# EAGLE design LasaurShield (EAGLE 5.11)
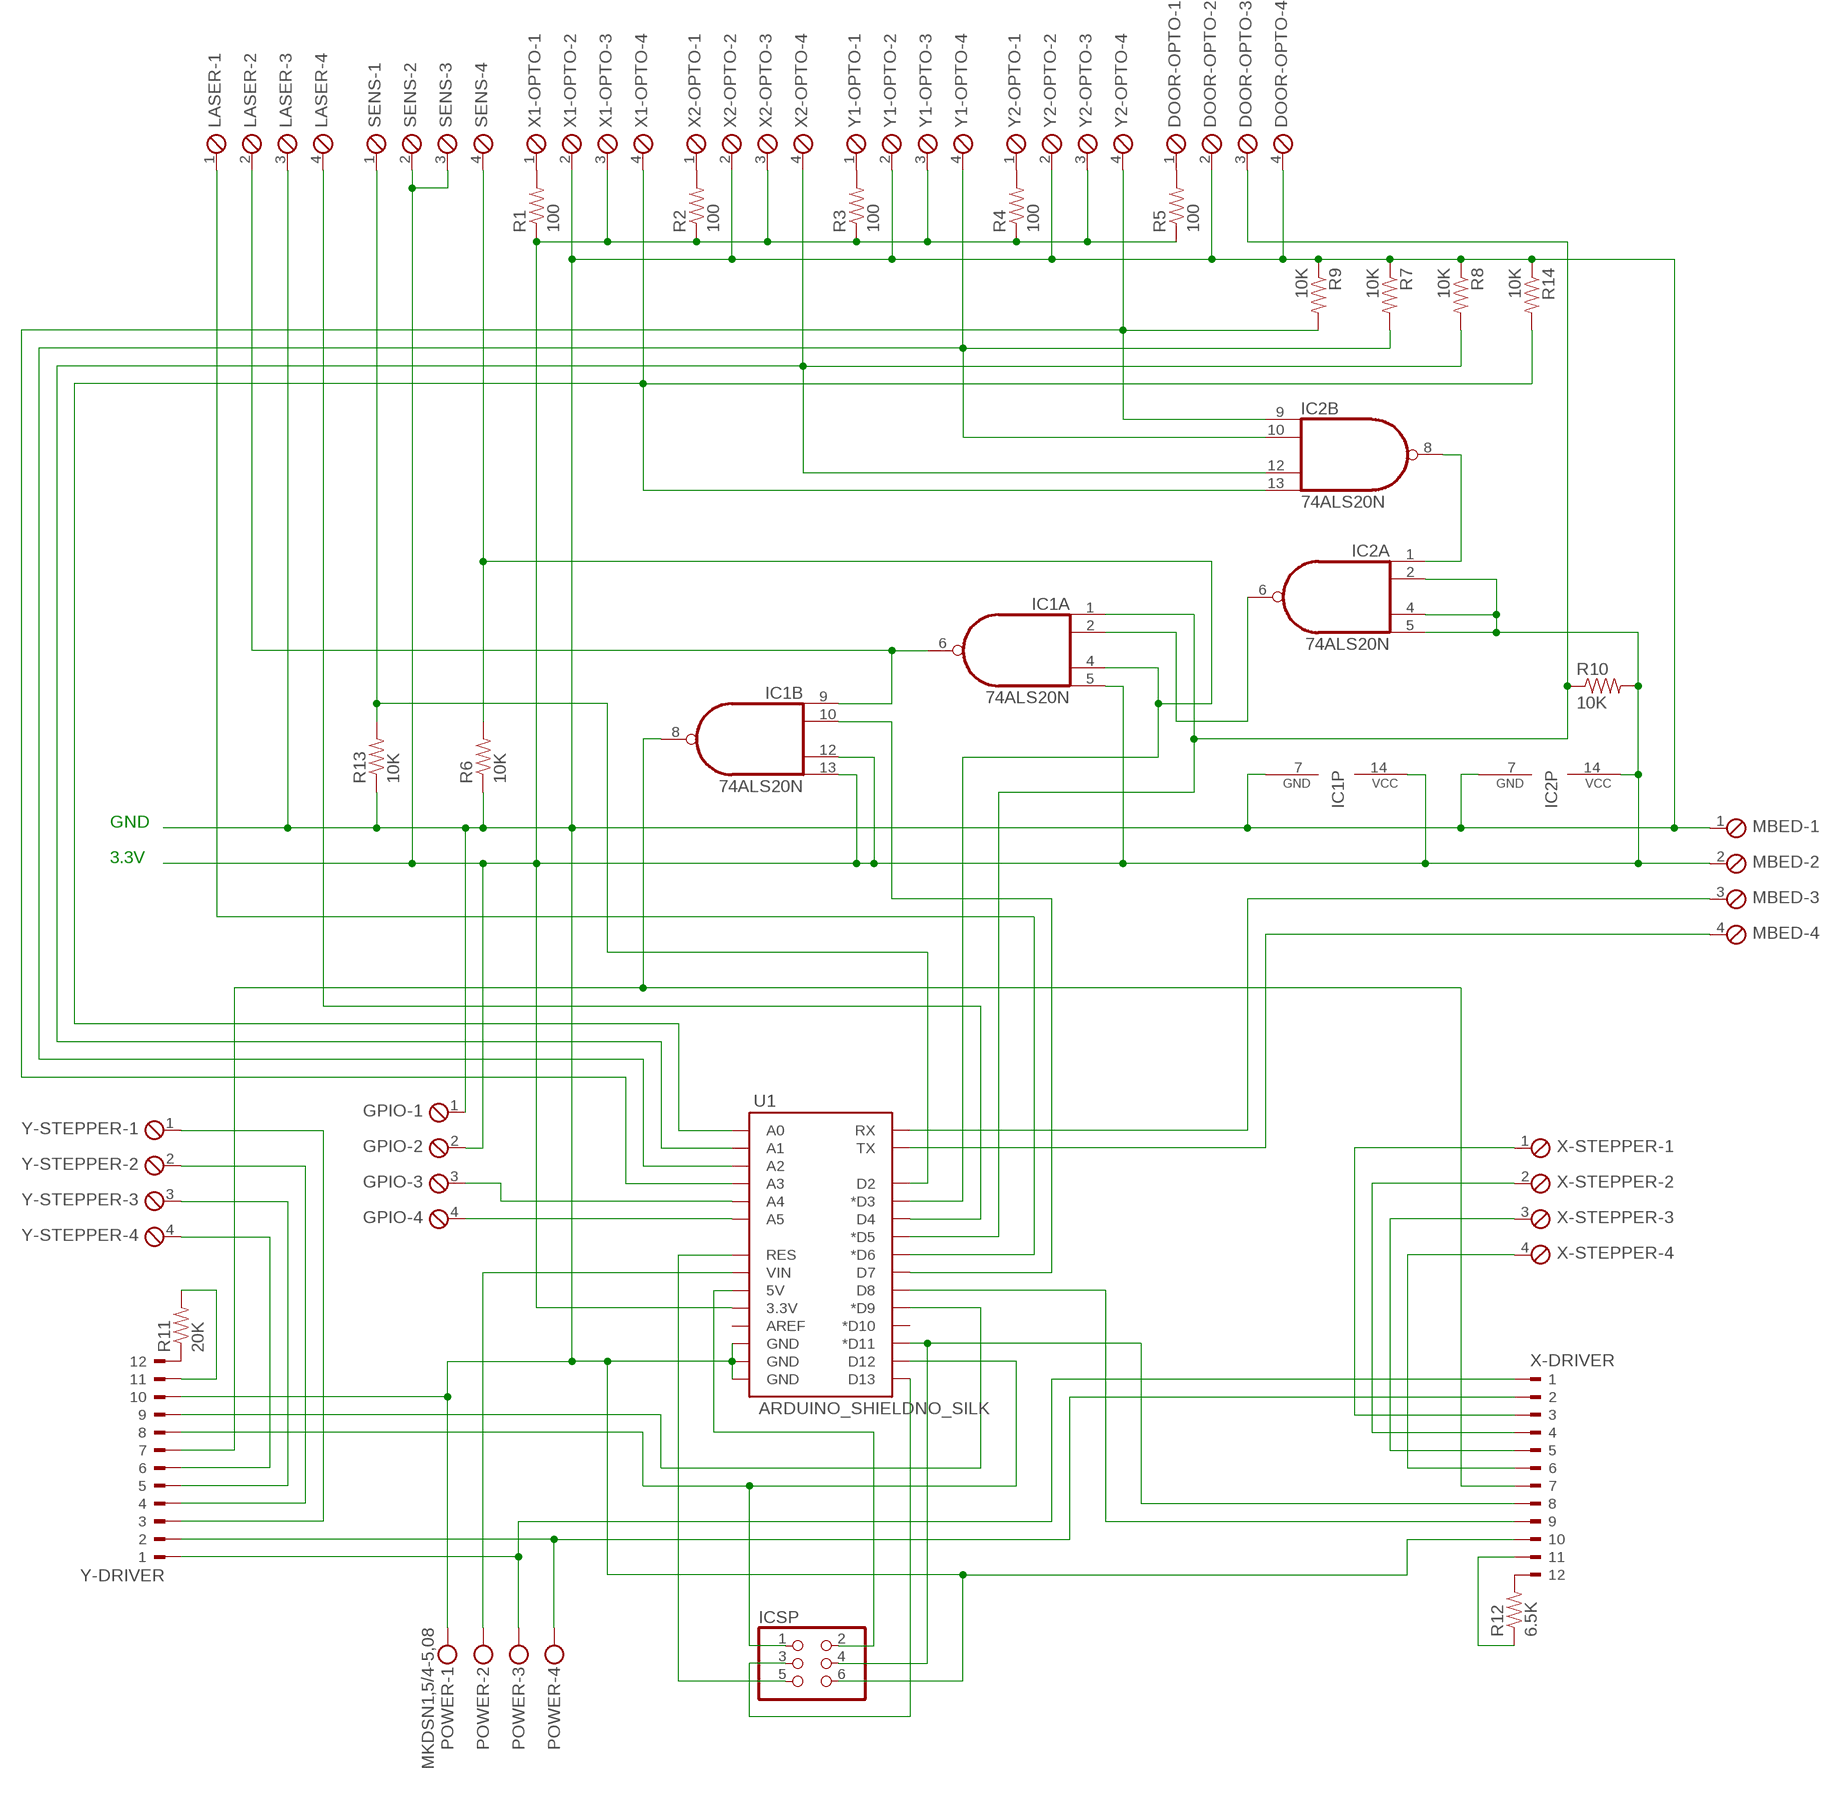
[diagram p0: schematic, sheet 1]

## Parts
DOOR-OPTO  MPT4  [4POL254]
GPIO  MPT4  [4POL254]
IC1  74ALS20N  [DIL14]
IC2  74ALS20N  [DIL14]
ICSP  PINHD-2X3  [2X03]
LASER  MPT4  [4POL254]
MBED  MPT4  [4POL254]
POWER  MKDSN1,5/4-5,08  [MKDSN1,5/4-5,08]
R1  100  RESISTORPTH-1/4W  [AXIAL-0.4]
R2  100  RESISTORPTH-1/4W  [AXIAL-0.4]
R3  100  RESISTORPTH-1/4W  [AXIAL-0.4]
R4  100  RESISTORPTH-1/4W  [AXIAL-0.4]
R5  100  RESISTORPTH-1/4W  [AXIAL-0.4]
R6  10K  RESISTORPTH-1/4W  [AXIAL-0.4]
R7  10K  RESISTORPTH-1/4W  [AXIAL-0.4]
R8  10K  RESISTORPTH-1/4W  [AXIAL-0.4]
R9  10K  RESISTORPTH-1/4W  [AXIAL-0.4]
R10  10K  RESISTORPTH-1/4W  [AXIAL-0.4]
R11  20K  RESISTORPTH-1/4W  [AXIAL-0.4]
R12  6.5K  RESISTORPTH-1/4W  [AXIAL-0.4]
R13  10K  RESISTORPTH-1/4W  [AXIAL-0.4]
R14  10K  RESISTORPTH-1/4W  [AXIAL-0.4]
SENS  MPT4  [4POL254]
U1  ARDUINO_SHIELDNO_SILK  [DUEMILANOVE_VIAS]
X1-OPTO  MPT4  [4POL254]
X2-OPTO  MPT4  [4POL254]
X-DRIVER  180-12  [180-12]
X-STEPPER  MPT4  [4POL254]
Y1-OPTO  MPT4  [4POL254]
Y2-OPTO  MPT4  [4POL254]
Y-DRIVER  180-12  [180-12]
Y-STEPPER  MPT4  [4POL254]

## Nets
N$1 [arduino power]: POWER.2 U1.VIN
N$2: GPIO.3 U1.A4
N$3 [stepper power]: POWER.3 X-DRIVER.1 Y-DRIVER.1
N$4 [stepper power]: POWER.4 X-DRIVER.2 Y-DRIVER.2
N$5: IC2.13(B:I3) R14.P$2 U1.A0 X1-OPTO.4
N$6: R1.P$2 X1-OPTO.1
N$7: IC1.2(A:I1) IC2.6(A:O)
N$8: IC2.9(B:I0) R9.P$2 U1.A3 Y2-OPTO.4
N$9: IC2.1(A:I0) IC2.8(B:O)
N$10: GPIO.4 U1.A5
N$11: IC1.6(A:O) IC1.9(B:I0) LASER.2
N$12: DOOR-OPTO.3 IC1.1(A:I0) R10.P$1 U1.D5(*D5)
N$13: IC1.10(B:I1) U1.D7
N$14: R11.P$1 Y-DRIVER.12
N$15: R11.P$2 Y-DRIVER.11
N$16: R12.P$2 X-DRIVER.12
N$17: R12.P$1 X-DRIVER.11
N$18: R2.P$2 X2-OPTO.1
N$19: R3.P$2 Y1-OPTO.1
N$20: R4.P$2 Y2-OPTO.1
N$21: DOOR-OPTO.1 R5.P$2
N$22 [stepper control]: Y-DRIVER.3 Y-STEPPER.1
N$23 [stepper control]: Y-DRIVER.4 Y-STEPPER.2
N$24 [stepper control]: Y-DRIVER.5 Y-STEPPER.3
N$25 [stepper control]: Y-DRIVER.6 Y-STEPPER.4
N$26 [stepper control]: X-DRIVER.3 X-STEPPER.1
N$27 [stepper control]: X-DRIVER.4 X-STEPPER.2
N$28 [stepper control]: X-DRIVER.5 X-STEPPER.3
N$29 [stepper control]: X-DRIVER.6 X-STEPPER.4
N$30: ICSP.4 U1.D11(*D11) X-DRIVER.8
N$31: U1.D9(*D9) Y-DRIVER.9
N$32: U1.D8 X-DRIVER.9
N$33 [arduino power]: DOOR-OPTO.2 DOOR-OPTO.4 GPIO.1 IC1.7(P:GND) IC2.7(P:GND) ICSP.6 LASER.3 MBED.1 POWER.1 R6.P$1 R7.P$1 R8.P$1 R9.P$1 R13.P$1 R14.P$1 U1.GND@0(GND) U1.GND@1(GND) U1.GND@2(GND) X1-OPTO.2 X2-OPTO.2 X-DRIVER.10 Y1-OPTO.2 Y2-OPTO.2 Y-DRIVER.10
N$34: IC2.12(B:I2) R8.P$2 U1.A1 X2-OPTO.4
N$35: LASER.1 U1.D6(*D6)
N$36: IC1.4(A:I2) R6.P$2 SENS.4 U1.D3(*D3)
N$37: IC1.8(B:O) X-DRIVER.7 Y-DRIVER.7
N$38: LASER.4 U1.D4
N$39: R13.P$2 SENS.1 U1.D2
N$41: ICSP.3 U1.D13
N$42: ICSP.5 U1.RES
N$43: MBED.3 U1.RX
N$44: ICSP.2 U1.5V
N$45: MBED.4 U1.TX
N$49: ICSP.1 U1.D12 Y-DRIVER.8
N$50: GPIO.2 IC1.5(A:I3) IC1.12(B:I2) IC1.13(B:I3) IC1.14(P:VCC) IC2.2(A:I1) IC2.4(A:I2) IC2.5(A:I3) IC2.14(P:VCC) MBED.2 R1.P$1 R2.P$1 R3.P$1 R4.P$1 R5.P$1 R10.P$2 SENS.2 SENS.3 U1.3.3V X1-OPTO.3 X2-OPTO.3 Y1-OPTO.3 Y2-OPTO.3
N$51: IC2.10(B:I1) R7.P$2 U1.A2 Y1-OPTO.4
Unconnected: U1.AREF U1.D10(*D10)

## Notes on the sheet
- GND
- 3.3V

## Library data of the parts
DOOR-OPTO GPIO LASER MBED SENS X1-OPTO X2-OPTO X-STEPPER Y1-OPTO Y2-OPTO Y-STEPPER = con-phoenix-254:MPT4: PHOENIX CONNECTOR; OC_FARNELL: unknown; OC_NEWARK: unknown
IC1 IC2 = 74xx-us:74*20: Dual 4-input NAND gate
ICSP = SparkFun:PINHD-2X3: PIN HEADER
POWER = con-phoenix-508:MKDSN1,5/4-5,08: MKDSN 1,5/ 4-5,08 Printklemme Nennstrom: 13,5 A Nennspannung: 250 V Rastermaß: 5,08 mm Polzahl: 4 Anschlussart: Schraubanschluss Montage: Löten Anschlussrichtung Leiter/Platine: 0 ° Artikelnummer: 1729144 Source: http://eshop.phoenixcontact.com .. 1729144.pdf; MPN: SMKDSN1,5/4-5,08; OC_FARNELL: 1792905; OC_NEWARK: 70R0300
R1-R14 = SparkFun:RESISTOR: Resistor Basic schematic elements and footprints for 0603, 1206, and PTH resistors.
U1 = SparkFun:ARDUINO_SHIELD
X-DRIVER Y-DRIVER = con-weidmueller-sl35:180-12: WEIDMUELLER CLAMP CONNECTOR; OC_FARNELL: unknown; OC_NEWARK: unknown

## Net classes
1 stepper power: width 2.032 mm, drill 0.508 mm, clearance 0.508 mm
2 stepper control: width 1.27 mm, drill 0.381 mm, clearance 0.381 mm
3 arduino power: width 1.016 mm, drill 0.254 mm, clearance 0.254 mm

## Board
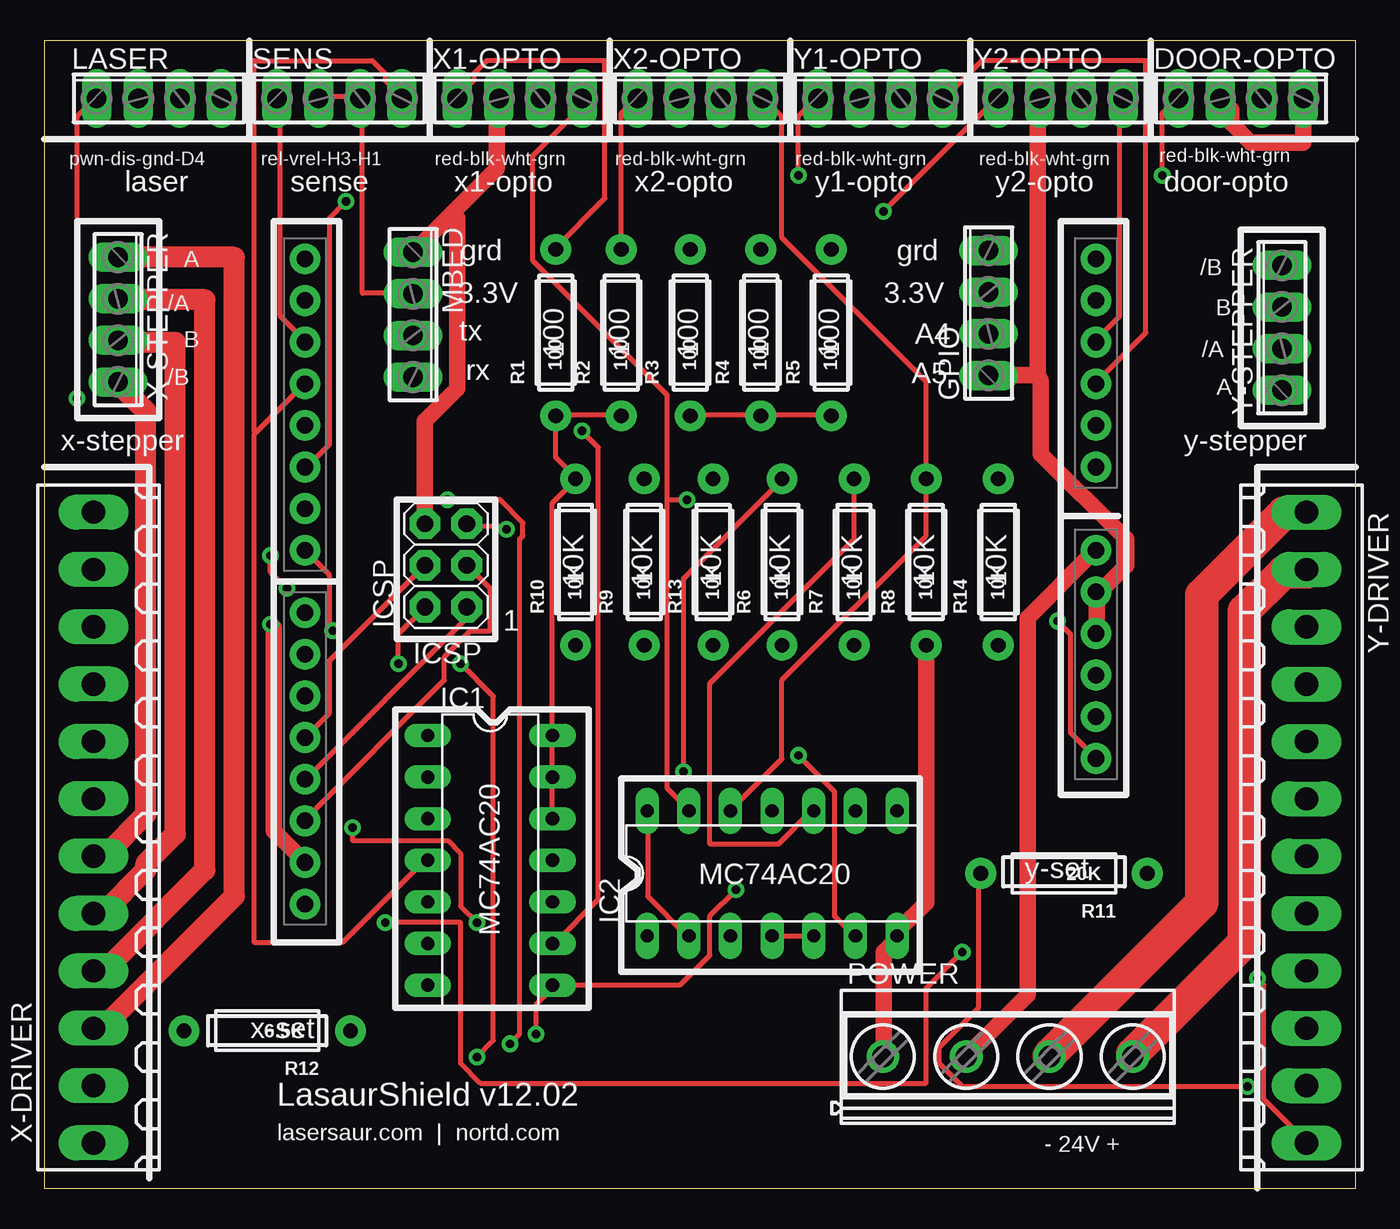
[diagram p1: board, top side]
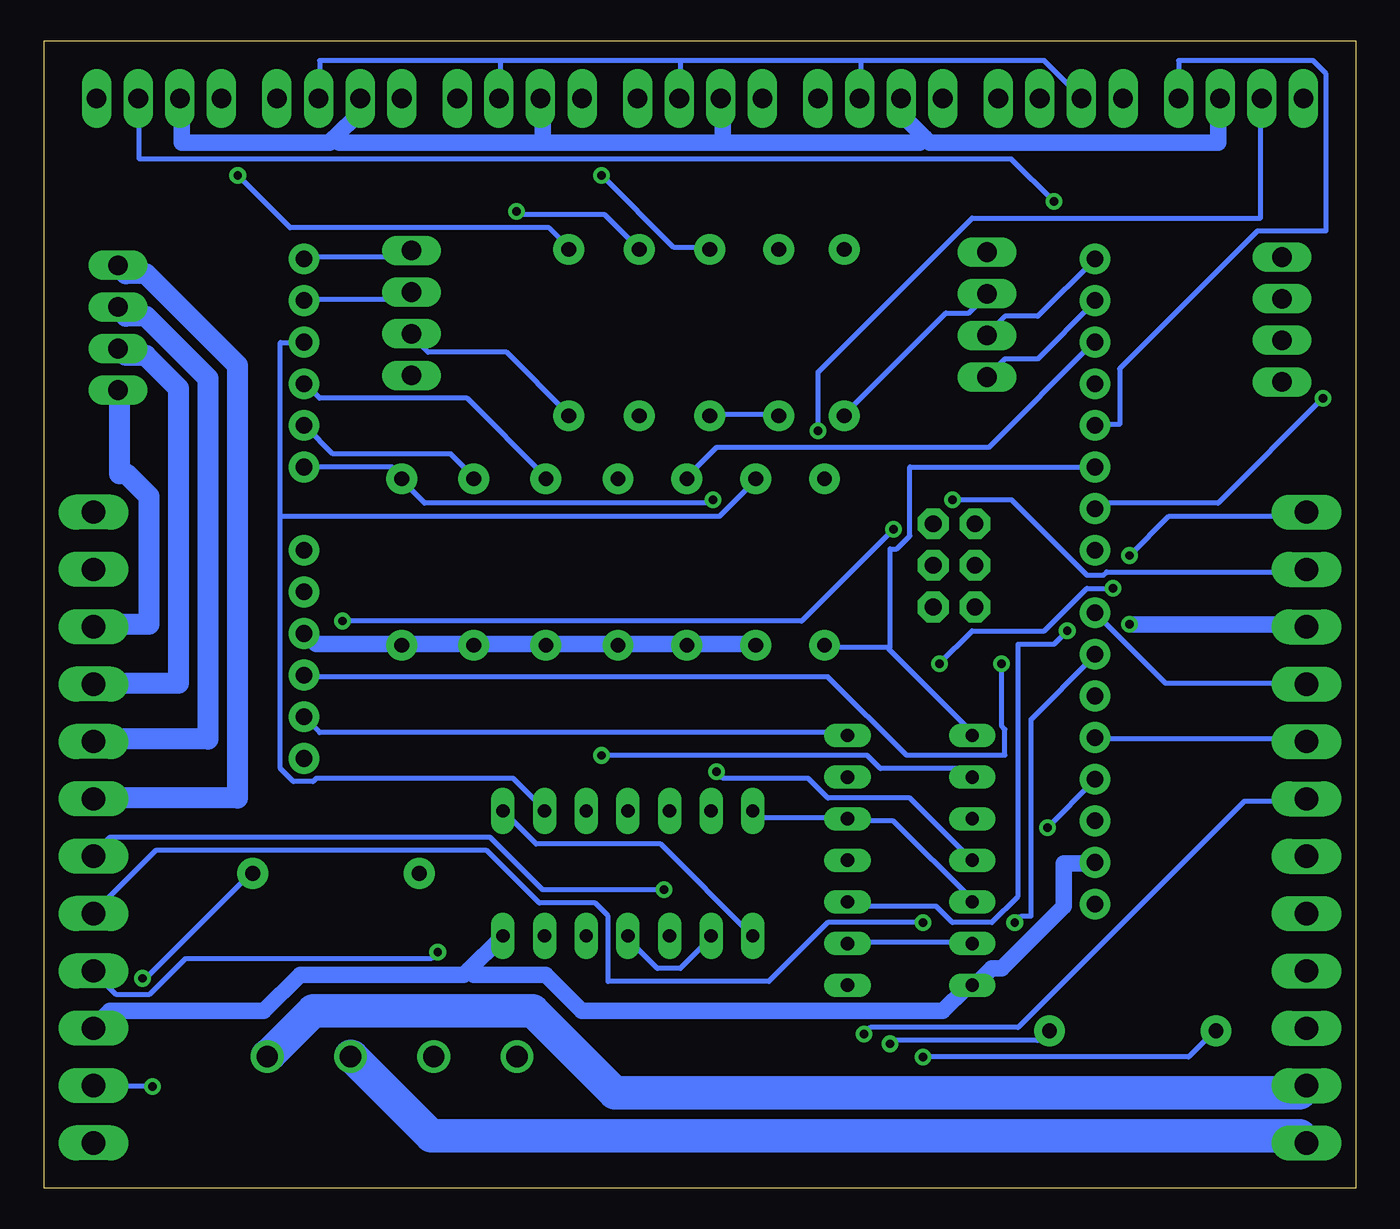
[diagram p2: board, bottom side, seen from below]

Size 80 x 70 mm. Coordinates in mm from the lower left corner, seen from the top.
Outline: 0,0 80,0 80,70 0,70 0,0
Copper layers (1*16): Top 0.035mm / dielectric 1.5mm / Bottom 0.035mm
Design rules "LasaurShield": minimum track width 12mil, minimum drill 20mil, track to track 12mil, track to pad 12mil, pad to pad 12mil, via to via 12mil, smd to smd 8mil, copper to edge 15mil, drill to drill 12mil, minimum pad ring 12mil, minimum via ring 10mil, stop-mask expansion 4mil, vias tented up to drill 25mil, thermal gap 10mil

### Footprints (pad centres in the part's own frame; a part is rotated, then mirrored left to right if it is on the bottom)
4POL254 = drill 1.2 long: 1 -3.81,0; 2 -1.27,0; 3 1.27,0; 4 3.81,0
DIL14 = drill 0.813 long: 1 -7.62,-3.81; 2 -5.08,-3.81; 3 -2.54,-3.81; 4 0,-3.81; 5 2.54,-3.81; 6 5.08,-3.81; 7 7.62,-3.81; 8 7.62,3.81; 9 5.08,3.81; 10 2.54,3.81; 11 0,3.81; 12 -2.54,3.81; 13 -5.08,3.81; 14 -7.62,3.81
2X03 = drill 1.016 pad 1.88 octagon: 1 -2.54,-1.27; 2 -2.54,1.27; 3 0,-1.27; 4 0,1.27; 5 2.54,-1.27; 6 2.54,1.27
MKDSN1,5/4-5,08 = drill 1.3 pad 2 round: 1 -7.641,0.025; 2 -2.561,0.025; 3 2.519,0.025; 4 7.599,0.025
AXIAL-0.4 = drill 0.9 pad 1.88 round: P$1 -5.08,0; P$2 5.08,0
DUEMILANOVE_VIAS = drill 1.016 pad 1.88 round: 3.3V 50.8,13.97; 5V 50.8,16.51; A0 50.8,29.21; A1 50.8,31.75; A2 50.8,34.29; A3 50.8,36.83; A4 50.8,39.37; A5 50.8,41.91; AREF 2.54,2.54; D2 2.54,36.83; D3 2.54,34.29; D4 2.54,31.75; D5 2.54,29.21; D6 2.54,26.67; D7 2.54,24.13; D8 2.54,20.32; D9 2.54,17.78; D10 2.54,15.24; D11 2.54,12.7; D12 2.54,10.16; D13 2.54,7.62; GND@0 50.8,19.05; GND@1 50.8,21.59; GND@2 2.54,5.08; RES 50.8,11.43; RX 2.54,41.91; TX 2.54,39.37; VIN 50.8,24.13
180-12 = drill 1.422 long: 1 -19.25,0; 2 -15.75,0; 3 -12.25,0; 4 -8.75,0; 5 -5.25,0; 6 -1.75,0; 7 1.75,0; 8 5.25,0; 9 8.75,0; 10 12.25,0; 11 15.75,0; 12 19.25,0

### Placement (x,y rotation side)
DOOR-OPTO  73,66.5 0 top
GPIO  57.6,53.4 90 top
IC1  27.2,20 270 top
IC2  44.4,19.2 0 top
ICSP  24.5,38 90 top
LASER  7,66.5 0 top
MBED  22.5,53.3 270 top
POWER  58.8,8 0 top
R1  31.2,52.2 90 top
R2  35.2,52.2 90 top
R3  39.4,52.2 90 top
R4  43.7,52.2 90 top
R5  48,52.2 90 top
R6  45,38.2 90 top
R7  49.4,38.2 90 top
R8  53.8,38.2 90 top
R9  36.6,38.2 90 top
R10  32.4,38.2 90 top
R11  62.2,19.2 180 top
R12  13.6,9.6 180 top
R13  40.8,38.2 90 top
R14  58.2,38.2 90 top
SENS  18,66.5 0 top
U1  13.36,14.79 0 top
X1-OPTO  29,66.5 0 top
X2-OPTO  40,66.5 0 top
X-DRIVER  3,22 90 top
X-STEPPER  4.5,53 270 top
Y1-OPTO  51,66.5 0 top
Y2-OPTO  62,66.5 0 top
Y-DRIVER  77,22 270 top
Y-STEPPER  75.5,52.5 90 top

### Tracks (layer width: path | path; a pad name or v marks a point on that pad's centre or on a via)
N$1
  Top 1.016: U1.VIN 64,38.8 60,34.8 60,11.8 56.4,8.2 POWER.2
N$2
  Bottom 0.305: GPIO.3 57.6,54.6 58,54.2 64,54.2 U1.A4
N$3
  Top 2.032: POWER.3 61.4,8.2 70.6,17.4 70.6,36.2 75.6,41.2 77,41.2 Y-DRIVER.1
  Bottom 2.032: X-DRIVER.1 3,2.8 3.4,3.2 56.4,3.2 61.2,8 POWER.3
N$4
  Top 2.032: POWER.4 66.4,8.2 73.2,15 73.2,35.2 75.6,37.6 77,37.6 Y-DRIVER.2
  Bottom 2.032: X-DRIVER.2 3,6.2 3.4,5.8 45.2,5.8 50.2,10.8 63.6,10.8 66.2,8.2 POWER.4
N$5  (via drill 0.51)
  Top 0.305: 38,42 38,48.4 29.8,56.6 29.8,63 32.8,66 32.8,66.4 X1-OPTO.4 | 38,42 38,24.4 39.2,23.2 IC2.13 | 38,42 v39.2,42
  Bottom 0.305: U1.A0 58.8,44 58.2,43.4 R14.P$2 58.2,43.2 56.8,41.8 39.4,41.8 v39.2,42
N$6
  Top 0.305: X1-OPTO.1 25.2,66.6 26.2,67.6 26.2,68 27,68.8 34.2,68.8 34.2,60.4 31.2,57.4 R1.P$2
N$7  (via drill 0.51)
  Top 0.305: v46,26.4 48.2,24.2 48.2,16.6 49.4,15.4 IC2.6
  Bottom 0.305: v46,26.4 29.8,26.4 29,25.6 23.8,25.6 23.4,25.2 IC1.2
N$8
  Top 0.305: Y2-OPTO.4 65.8,66.4 65.6,66.2 65.6,53.2 64.2,51.8 U1.A3
  Bottom 0.305: 65.6,41 65.6,51.6 64.2,51.6 U1.A3 | 65.6,41 65.6,25.6 64.8,24.8 63.6,24.8 63.4,25 51.4,25 49.6,23.2 IC2.9 | 65.6,41 38.8,41 36.6,43.2 R9.P$2
N$9
  Bottom 0.305: IC2.1 36.8,15.4 42.4,21 50,21 52,23 IC2.8
N$10
  Bottom 0.305: GPIO.4 58,56.8 64,56.8 U1.A5
N$11  (via drill 0.51)
  Top 0.305: v32.8,46.2 33.8,45.2 33.8,17.6 31.2,15 IC1.9
  Bottom 0.305: IC1.6 23.4,15 31,15 IC1.9 | v32.8,46.2 32.8,49.8 23.4,59.2 5.8,59.2 5.8,66.4 LASER.2
N$12  (via drill 0.51)
  Top 0.305: v18.4,60.2 17.4,59.2 17.4,45.4 16,44 U1.D5
  Bottom 0.305: 28.5,32.9 28.6,33 32.4,33 R10.P$1 | 28.5,32.9 23.4,27.8 IC1.1 | v18.4,60.2 21,62.8 74.2,62.8 74.2,66.4 DOOR-OPTO.3 | 28.5,32.9 28.4,33 28.4,39 28,39 27.2,39.8 27.2,44 U1.D5
N$13  (via drill 0.51)
  Top 0.305: v17.6,34 17.4,34.2 17.4,37.4 16,38.8 U1.D7
  Bottom 0.305: v17.6,34 18.4,33.2 20.6,33.2 20.6,17.8 22.2,16.2 24.6,16.2 25.6,17.2 30.8,17.2 31,17.4 IC1.10
N$14  (via drill 0.51)
  Top 0.305: v74,12.8 74.4,12.4 74.4,5.4 77,2.8 Y-DRIVER.12
  Bottom 0.305: v74,12.8 73.8,12.8 67.4,19.2 R11.P$1
N$15  (via drill 0.51)
  Top 0.305: v73.4,6.2 56,6.2 54.6,7.6 54.6,8.6 57,11 57,19.2 R11.P$2
  Bottom 0.305: v73.4,6.2 77,6.2 Y-DRIVER.11
N$16  (via drill 0.51)
  Top 0.305: v26.4,8 27.4,9 27.4,30 v25.4,32 | v14.8,36.6 13.8,37.6 v13.8,38.6
  Bottom 0.305: v26.4,8 10.2,8 8.6,9.6 R12.P$2 | v25.4,32 23.4,34 19,34 16.4,36.6 v14.8,36.6 | v13.8,38.6 11.4,41 3.2,41 3,41.2 X-DRIVER.12
N$17  (via drill 0.51)
  Top 0.305: v28.4,8.8 29,9.4 29,39.6 29.2,39.8 29.2,40.6 27.8,42 v24.6,42
  Bottom 0.305: v28.4,8.8 28.2,9 19.4,9 18.8,9.6 R12.P$1 | v24.6,42 21,42 16.4,37.4 15.4,37.4 15.2,37.6 3,37.6 X-DRIVER.11
N$18
  Top 0.305: X2-OPTO.1 36,66.4 35.2,65.6 R2.P$2
N$19  (via drill 0.51)
  Top 0.305: v46,61.8 46,65.4 47,66.4 Y1-OPTO.1
  Bottom 0.305: v46,61.8 41.6,57.4 39.4,57.4 R3.P$2
N$20  (via drill 0.51)
  Top 0.305: v51.2,59.6 58,66.4 Y2-OPTO.1
  Bottom 0.305: v51.2,59.6 51,59.4 45.8,59.4 43.8,57.4 R4.P$2
N$21  (via drill 0.51)
  Top 0.305: v68.2,61.8 68.2,65.6 69,66.4 DOOR-OPTO.1
  Bottom 0.305: v68.2,61.8 65,58.6 49.2,58.6 48,57.4 R5.P$2
N$22
  Bottom 1.27: Y-STEPPER.1 75.4,48.6 75.4,43.6 75,43.6 73.6,42.2 73.6,34.4 77,34.4 Y-DRIVER.3
N$23
  Bottom 1.27: Y-STEPPER.2 75.4,51.2 75,50.8 73.8,50.8 71.8,48.8 71.8,30.8 77,30.8 Y-DRIVER.4
N$24
  Bottom 1.27: Y-STEPPER.3 75.4,53.6 75,53.2 73.8,53.2 70,49.4 70,27.4 77,27.4 Y-DRIVER.5
N$25
  Bottom 1.27: Y-STEPPER.4 75.4,56.2 75,55.8 73.8,55.8 68.2,50.2 68.2,23.8 77,23.8 Y-DRIVER.6
N$26
  Top 1.27: X-STEPPER.1 4.6,56.8 11.6,56.8 11.6,17.8 3.6,9.8 3,9.8 X-DRIVER.3
N$27
  Top 1.27: X-STEPPER.2 4.6,54.2 9.8,54.2 9.8,19.4 3.8,13.4 3,13.4 X-DRIVER.4
N$28
  Top 1.27: X-STEPPER.3 4.6,51.6 8,51.6 8,21.6 6.2,19.8 6.2,19.4 3.6,16.8 3,16.8 X-DRIVER.5
N$29
  Top 1.27: X-STEPPER.4 4.6,49 6.2,47.4 6.2,22.8 3.8,20.4 3,20.4 X-DRIVER.6
N$30
  Top 0.305: ICSP.4 23.2,38 17.4,32.2 17.4,29 16,27.6 U1.D11
  Bottom 0.305: U1.D11 15.8,27.4 3,27.4 X-DRIVER.8
N$31  (via drill 0.51)
  Top 0.305: v20.8,16.2 25.4,16.2 25.4,7.6 26.6,6.4 53.8,6.4 53.8,12.2 v56,14.4
  Bottom 0.305: v20.8,16.2 20.4,16.6 19.8,16.6 19.8,28.6 16,32.4 U1.D9 | v56,14.4 56.4,14 71.4,14 73.6,11.8 75.6,11.8 77,13.2 Y-DRIVER.9
N$32
  Bottom 0.305: U1.D8 15.8,35 11.6,30.8 3,30.8 X-DRIVER.9
N$33  (via drill 0.51)
  Top 1.016: 24.9,59.5 27.6,62.2 27.6,66.4 X1-OPTO.2 | 24.9,59.5 22.6,57.2 MBED.1 | ICSP.6 23.2,40.6 23.2,46.8 25.2,48.8 25.2,59.2 24.9,59.5 | v13.8,34.4 14,34.2 14,21.8 15.8,20 U1.GND@2 | POWER.1 51.2,8.2 51.2,14.4 52,15.2 IC2.7 52.2,15.8 53.8,17.4 R8.P$1 | U1.GND@0 64.2,34 64.2,36.2 U1.GND@1 64.6,36.6 66,38 66,39.6 60.8,44.8 60.8,49.2 60.6,49.6 | DOOR-OPTO.2 71.8,66.4 72.4,65.8 72.4,65 73.6,63.8 76.8,63.8 76.8,66.4 DOOR-OPTO.4 | 60.6,49.6 GPIO.1 | 60.6,49.6 60.6,66.4 Y2-OPTO.2
  Bottom 1.016: 26.3,64.1 27.6,65.4 27.6,66.4 X1-OPTO.2 | 26.3,64.1 26,63.8 8.4,63.8 8.4,66.4 LASER.3 | 38.6,63.8 38.6,66.4 X2-OPTO.2 | 38.6,63.8 26.6,63.8 26.3,64.1 | 49.6,63.8 49.6,66.4 Y1-OPTO.2 | 49.6,63.8 38.6,63.8 | U1.GND@2 16,19.8 17.8,19.8 17.8,17.2 21.6,13.4 22.2,13.4 23.2,12.4 IC1.7 23.8,12.2 25.2,10.8 47.2,10.8 49.4,13 53.8,13 54.1,13.3 | v13.8,34.4 3,34.4 X-DRIVER.10 | 54.1,13.3 52.2,15.2 IC2.7 | 54.1,13.3 54.4,13 64.4,13 66.6,10.8 76,10.8 77,9.8 Y-DRIVER.10 | R9.P$1 36.6,33.2 40.8,33.2 R13.P$1 41.2,33.2 45,33.2 R6.P$1 45.4,33.2 49.4,33.2 R7.P$1 49.8,33.2 53.8,33.2 R8.P$1 54.2,33.2 58.2,33.2 R14.P$1 58.6,33.2 63.4,33.2 64,33.8 U1.GND@0 | 62.3,64.1 60.8,65.6 60.8,66.4 Y2-OPTO.2 | 62.3,64.1 62.6,63.8 71.6,63.8 71.6,66.4 DOOR-OPTO.2 | 49.6,63.8 62,63.8 62.3,64.1
N$34
  Top 0.305: IC2.12 42,23.2 45,26.2 45,31 53.8,39.8 R8.P$2 53.8,49.2 45,58 45,65.4 44,66.4 X2-OPTO.4
  Bottom 0.305: U1.A1 64,46.4 62.4,44.8 55.2,44.8 53.8,43.4 R8.P$2
N$35  (via drill 0.51)
  Top 0.305: v2,48.2 2,65.4 3,66.4 LASER.1
  Bottom 0.305: v2,48.2 8.4,41.8 15.6,41.8 15.8,41.6 U1.D6
N$36  (via drill 0.51)
  Top 0.305: 12.9,46.1 15.8,49 U1.D3 | 12.9,46.1 12.8,46 12.8,15 18.2,15 23.2,20 IC1.4 | SENS.4 21.8,66.6 20.8,67.6 20.8,68 20,68.8 12.8,68.8 12.8,46.2 12.9,46.1 | v39,25.4 39,37.2 45,43.2 R6.P$2
  Bottom 0.305: v39,25.4 38.6,25 33.4,25 32.2,23.8 27.2,23.8 IC1.4
N$37  (via drill 0.51)
  Top 0.305: v30,9.4 30,11.2 31,12.2 IC1.8 31.2,12.4 38.8,12.4 40.6,14.2 40.6,16.6 v42.2,18.2
  Bottom 0.305: IC1.8 31.2,12.2 | v30,9.4 29.6,9.8 20.6,9.8 6.8,23.6 3,23.6 X-DRIVER.7 | v42.2,18.2 49.6,18.2 52.8,21.4 76,21.4 77,20.4 Y-DRIVER.7
N$38
  Bottom 0.305: LASER.4 10.8,66.6 10.8,68.8 2.6,68.8 1.8,68 1.8,58.4 6,58.4 14.4,50 14.4,46.6 15.8,46.6 U1.D4
N$39
  Top 0.305: SENS.1 14.2,66.4 14.4,66.2 14.4,53.2 15.8,51.8 U1.D2
  Bottom 0.305: R13.P$2 40.8,43.4 39,45.2 22.4,45.2 16,51.6 U1.D2
N$41
  Top 0.305: U1.D13 16,22.6 24.4,31 24.4,32.4 26,34 27.2,34 27.2,36.6 25.8,38 ICSP.3
N$42  (via drill 0.51)
  Top 0.305: v28.2,40.2 28.2,40.4 25.8,40.4 ICSP.5 | v61.8,34.6 62.6,33.8 62.6,27.8 64,26.4 U1.RES
  Bottom 0.305: v28.2,40.2 33.8,34.6 v61.8,34.6
N$43
  Bottom 0.305: MBED.3 22.4,52.2 21.4,53.2 19.4,53.2 U1.RX
N$44  (via drill 0.51)
  Top 0.305: v21.6,32 21.6,33.8 23.2,35.4 ICSP.2
  Bottom 0.305: v21.6,32 21.6,28.2 21.4,28 21.4,26.4 27.4,26.4 32.2,31.2 64,31.2 U1.5V
N$45
  Bottom 0.305: MBED.4 22.4,49.6 21.4,50.6 19.4,50.6 16,54 U1.TX
N$49  (via drill 0.51)
  Top 0.305: U1.D12 16,25 25.6,34.6 25.6,35.4 ICSP.1 | v26.4,16.2 25.4,17.2 25.4,20.4 24.6,21.2 18.8,21.2 v18.8,22
  Bottom 0.305: v26.4,16.2 32.2,16.2 35.8,12.6 45.6,12.6 45.6,16.6 46.4,17.4 49.8,17.4 53,20.6 73.2,20.6 77,16.8 Y-DRIVER.8 | v18.8,22 16,24.8 U1.D12
N$50
  Top 0.305: IC1.12 31,22.6 31,25 IC1.13 31,25.2 31,27.6 IC1.14 31,27.8 31,41.8 32.4,43.2 R10.P$2 32.4,43.4 31.2,44.6 R1.P$1 31.2,47.2 35.2,47.2 R2.P$1 | IC2.4 46.8,15.4 IC2.5 | IC2.2 39.2,15.4 36.8,17.8 36.8,23 IC2.14 | R3.P$1 39.4,47.2 43.6,47.2 R4.P$1 43.8,47.2 48,47.2 R5.P$1 | SENS.2 16.8,66.6 19.2,66.6 SENS.3 19.4,66.4 19.4,54.6 22.4,54.6 MBED.2
  Bottom 0.305: IC1.5 23.4,17.6 28.2,22.4 31,22.4 IC1.12 31.2,22.6 36.2,22.6 36.6,23 IC2.14 | IC2.4 44.4,15.2 42.6,13.4 41.2,13.4 39.4,15.2 IC2.2 | U1.3.3V 63.2,27.8 31.2,27.8 IC1.14 | GPIO.2 57.6,52 56.6,51 51.8,51 48,47.2 R5.P$1 | MBED.2 22.6,54.4 23.6,53.4 25,53.4 31.2,47.2 R1.P$1 | R3.P$1 39.4,47.2 35.2,47.2 R2.P$1 | 30.2,68.8 30.2,66.6 X1-OPTO.3 | 30.2,68.8 19,68.8 16.8,66.6 SENS.2 | 41.2,68.8 41.2,66.6 X2-OPTO.3 | 30.2,68.8 41.2,68.8 | 52.2,68.8 52.2,66.6 Y1-OPTO.3 | 41.2,68.8 52.2,68.8 | 52.2,68.8 63.2,68.8 63.2,66.6 Y2-OPTO.3
N$51
  Top 0.305: IC2.10 46.8,23 44.8,21 40.6,21 40.6,30.8 49.4,39.6 R7.P$2 | Y1-OPTO.4 55,66.6 57.2,68.8 67.2,68.8 67.2,52.2 64.2,49.2 U1.A2
  Bottom 0.305: R7.P$2 49.4,43.4 54.2,48.2 63.2,48.2 64,49 U1.A2

### Text on the board
_tsilk: red-blk-wht-grn | pwn-dis-gnd-D4 | rel-vrel-H3-H1 | red-blk-wht-grn | red-blk-wht-grn | red-blk-wht-grn | red-blk-wht-grn | laser | sense | x1-opto | x2-opto | y1-opto | y2-opto | door-opto | grd | grd | A | /B | /A | 3.3V | 3.3V | B | tx | A4 | B | 100 | 100 | 100 | 100 | 100 | /A | /B | rx | A5 | A | x-stepper | y-stepper | 10K | 10K | 10K | 10K | 10K | 10K | 10K | 1 | ICSP | MC74AC20 | y-set | MC74AC20 | x-set | LasaurShield v12.02 | lasersaur.com | nortd.com | - 24V +